# EAGLE schematic JoePip1 (EAGLE 7.6.0)
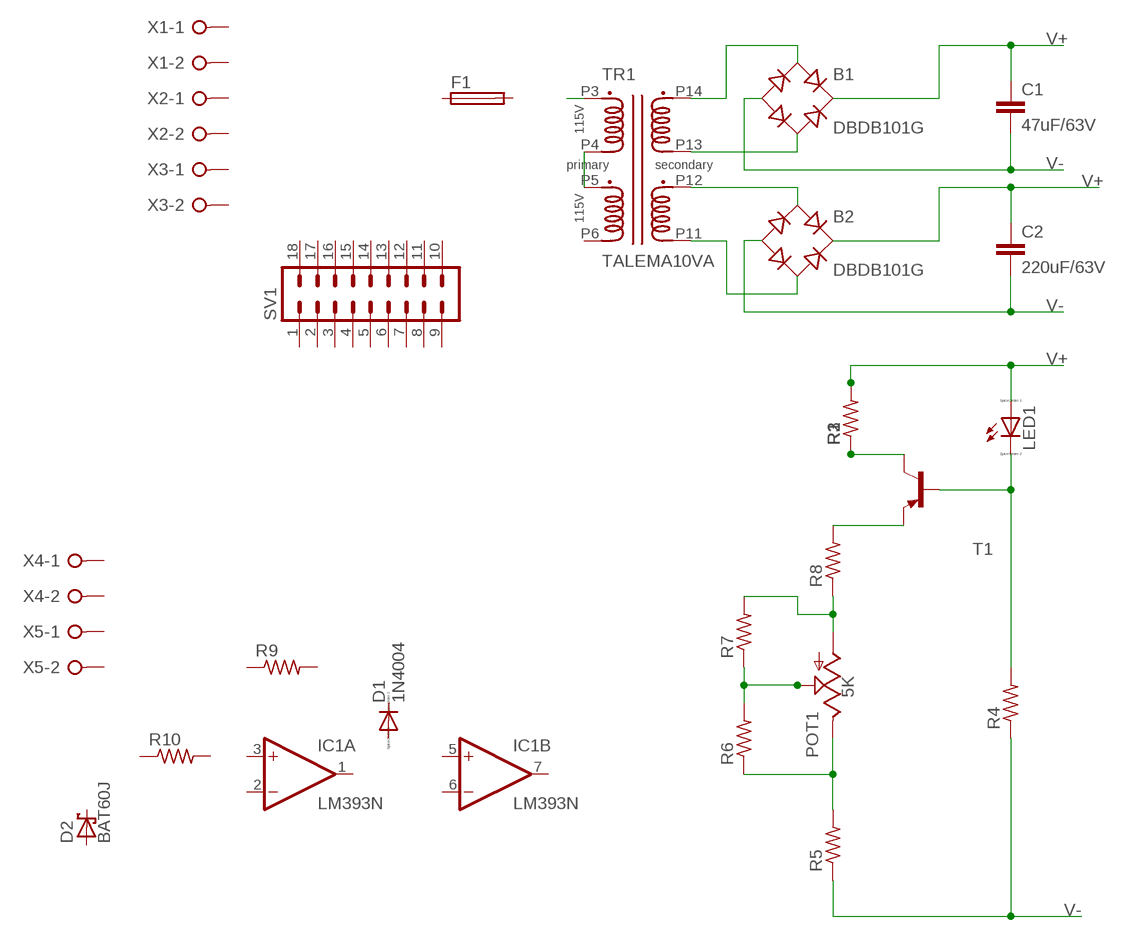
[diagram p0: schematic, sheet 1]

## Parts
B1  DBDB101G  [DB]
B2  DBDB101G  [DB]
C1  47uF/63V  C7.5/3  [C7.5B3]
C2  220uF/63V  C7.5/3  [C7.5B3]
D1  1N4004  [DO41-10]
D2  BAT60J  [SOD323_ST]
F1  GSH15  [GSH15]
IC1  LM393N  [DIL08]
LED1  LED_ELD260  [LED_LD260]
POT1  5K  TRIM_US-S64W  [S64W]
R1  R-US_0204/7  [0204/7]
R2  R-US_0204/7  [0204/7]
R3  R-US_0204/7  [0204/7]
R4  R-US_0204/7  [0204/7]
R5  R-US_0204/7  [0204/7]
R6  R-US_0204/7  [0204/7]
R7  R-US_0204/7  [0204/7]
R8  R-US_0204/7  [0204/7]
R9  R-US_0204/7  [0204/7]
R10  R-US_0204/7  [0204/7]
SV1  IC18P  [IC18P]
T1  -PNP-SOT93V  [SOT93V]
TR1  TALEMA10VA  [TALEMA10VA]
X1  W237-02P  [W237-132]
X2  W237-02P  [W237-132]
X3  W237-02P  [W237-132]
X4  W237-02P  [W237-132]
X5  W237-02P  [W237-132]

## Nets
N$1: B1.AC1 TR1.P14(S14)
N$2: B1.AC2 TR1.P13(S13)
N$3: TR1.P3
N$4: B2.AC2 TR1.P11(S11)
N$5: B2.AC1 TR1.P12(S12)
N$7: R1.1 R2.1 R3.1 T1.C
N$8: POT1.A R7.2 R8.1
N$9: TR1.P4 TR1.P5
N$10: R8.2 T1.E
N$11: LED1.K(C) R4.2 T1.B
N$12: POT1.S R6.2 R7.1
N$13: POT1.E R5.2 R6.1
V+: B1.+ B2.+ C1.1 C2.1 LED1.A R1.2 R2.2 R3.2
V-: B1.- B2.- C1.2 C2.2 R4.1 R5.1
Unconnected: D1.A D1.C D2.A D2.C F1.1 F1.2 IC1.1(A:OUT) IC1.2(A:-IN) IC1.3(A:+IN) IC1.5(B:+IN) IC1.6(B:-IN) IC1.7(B:OUT) R9.1 R9.2 R10.1 R10.2 SV1.1 SV1.2 SV1.3 SV1.4 SV1.5 SV1.6 SV1.7 SV1.8 SV1.9 SV1.10 SV1.11 SV1.12 SV1.13 SV1.14 SV1.15 SV1.16 SV1.17 SV1.18 TR1.P6 X1.1 X1.2 X2.1 X2.2 X3.1 X3.2 X4.1 X4.2 X5.1 X5.2

## Power pins joined to a net without a drawn wire
V+: IC1.8(P:V+)
V-: IC1.4(P:V-)

## Library data of the parts
B1 B2 = rectifier:DB?*G: Single Phase 1.0 AMP Glass Passivated Bridge Rectifier Taiwan Semiconductor Co.,Ltd. - TSC Source: http://www.taiwansemi.com/TSCbig5/ezcatfiles/cust/img/img/db101g.pdf http://www.ts.com.tw/db/pictures/modules/PDT/PDT060207001/DBLS201G.pdf
C1 C2 = capacitor-wima:C: CAPACITOR naming: grid - package width
D1 = diode:1N4004: DIODE general purpose rectifier, 1 A
D2 = diode:BAT60J: Schottky barrier diode Source: www.st.com, BAT60J.pdf
F1 = fuse:GSH15: FUSE HOLDER grid 15mm, 19649 Wickmann; MPN: 64900001039; OC_FARNELL: 1271673; OC_NEWARK: 02P0318
IC1 = linear:LM393: COMPARATOR
LED1 = eagle-ltspice:LED_E: LED Source: http://www.osram.convergy.de Source: www.luxeon.com Source: www.kingbright.com; SPICEMODEL: NONE; SPICEPREFIX: D; SPICETYPE: diode
POT1 = pot:TRIM_US-: POTENTIOMETER
R1-R10 = rcl:R-US_: RESISTOR, American symbol
SV1 = con-dil:IC18P: DIL CABLE CONNECTOR
T1 = transistor:*-PNP-: PNP Transistror
TR1 = pavouk:TALEMA10VA: TALEMA 10VA transformer
X1-X5 = con-wago-508:W237-02P: WAGO SREW CLAMP; OC_FARNELL: unknown; OC_NEWARK: unknown

## Net classes
0 default: width 0.762 mm, drill 0.61 mm, clearance 0.508 mm